# Altium schematic sheet Sch_sensors.SchDoc
size A
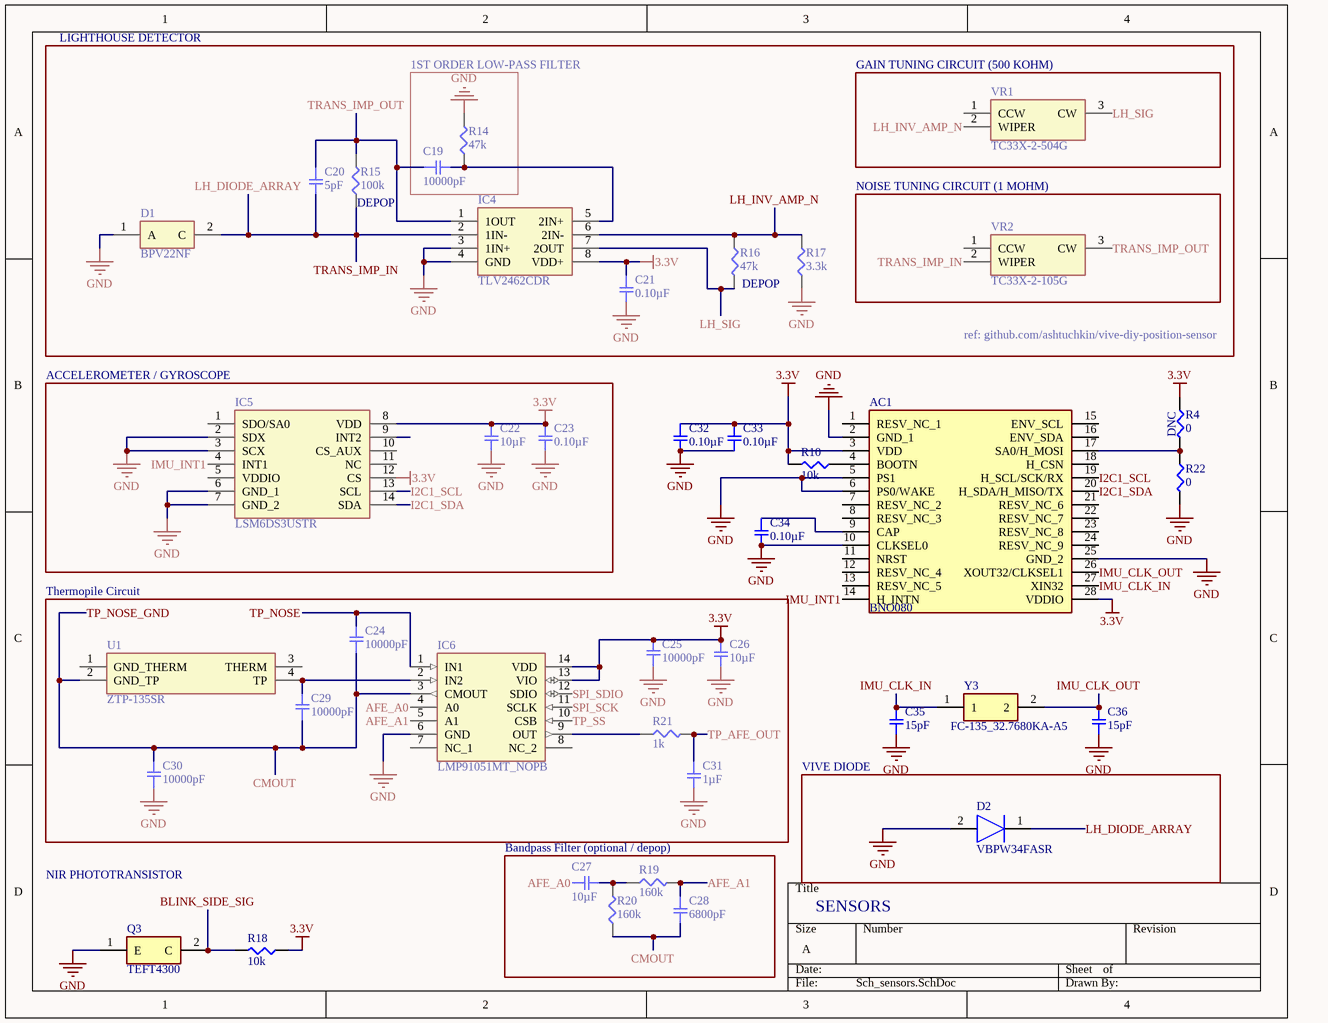
[diagram p0: Sch_sensors.SchDoc]

## Parts
AC1  BNO080  [BNO080]
C19  10000pF  [SMD-0402C]
C20  5pF  [SMD-0402C]
C21  0.10µF  [SMD-0402C]
C22  10µF  [SMD-0402C]
C23  0.10µF  [SMD-0402C]
C24  10000pF  [SMD-0402C]
C25  10000pF  [SMD-0402C]
C26  10µF  [SMD-0402C]
C27  10µF  [SMD-0402C]
C28  6800pF  [SMD-0402C]
C29  10000pF  [SMD-0402C]
C30  10000pF  [SMD-0402C]
C31  1µF  [SMD-0402C]
C32  0.10µF  [CAPC1005X55N]
C33  0.10µF  [CAPC1005X55N]
C34  0.10µF  [CAPC1005X55N]
C35  15pF  [CAPC1005X55N]
C36  15pF  [CAPC1005X55N]
D1  BPV22NF  [TO254P510X450X920-2P]
D2  VBPW34FASR  [VBPW34FASR]
IC4  TLV2462CDR  [SOIC127P600X175-8N]
IC5  LSM6DS3USTR  [LGA-14(2.5X3X0.86)]
IC6  LMP91051MT_NOPB  [SOP65P640X120-14N]
Q3  TEFT4300  [TEFT4300]
R4  0  [SMD-0402-RES]
R10  10k  [SMD-0402-RES]
R14  47k  [SMD-0402-RES]
R15  100k  [SMD-0402-RES]
R16  47k  [SMD-0402-RES]
R17  3.3k  [SMD-0402-RES]
R18  10k  [SMD-0402-RES]
R19  160k  [SMD-0402-RES]
R20  160k  [SMD-0402-RES]
R21  1k  [SMD-0402-RES]
R22  0  [SMD-0402-RES]
U1  ZTP-135SR  [ZTP-135SR]
VR1  TC33X-2-504G  [TC33X-2_1]
VR2  TC33X-2-105G  [TC33X-2_1]
Y3  FC-135_32.7680KA-A5  [FC135327680KAAG0]

## Blocks framed on the sheet
1ST ORDER LOW-PASS FILTER: C19 R14
GAIN TUNING CIRCUIT (500 KOHM): VR1
NOISE TUNING CIRCUIT (1 MOHM): VR2
ACCELEROMETER / GYROSCOPE: C22 C23 IC5
Thermopile Circuit: C24-C26 C29-C31 IC6 R21 U1
VIVE DIODE: D2
Bandpass Filter (optional / depop): C27 C28 R19 R20

## Nets
3.3V: AC1.3(VDD) AC1.28(VDDIO) C21.1 C22.1 C23.1 C25.2 C26.1 C32.1 C33.1 IC4.8(VDD+) IC5.8(VDD) IC5.12(CS) IC6.13(VIO) IC6.14(VDD) R4.1 R10.2 R18.1
GND: AC1.2(GND_1) AC1.5(PS1) AC1.6(PS0/WAKE) AC1.10(CLKSEL0) AC1.25(GND_2) C21.2 C22.2 C23.2 C25.1 C26.2 C30.1 C31.2 C32.2 C33.2 C34.2 C35.2 C36.2 D1.1(A) D2.2(K) IC4.3(1IN+) IC4.4(GND) IC5.2(SDX) IC5.3(SCX) IC5.6(GND_1) IC5.7(GND_2) IC6.6(GND) Q3.1(E) R14.2 R17.1 R22.2
AFE_A0: C27.1 IC6.4(A0)
AFE_A1: C28.1 IC6.5(A1) R19.2
BLINK_SIDE_SIG: Q3.2(C) R18.2
CMOUT: C24.1 C28.2 C29.1 C30.2 IC6.3(CMOUT) R20.1 U1.2(GND_TP)  [also labelled TP_NOSE_GND]
I2C1_SCL: AC1.19(H_SCL/SCK/RX) IC5.13(SCL)
I2C1_SDA: AC1.20(H_SDA/H_MISO/TX) IC5.14(SDA)
IMU_CLK_IN: AC1.27(XIN32) C35.1 Y3.1
IMU_CLK_OUT: AC1.26(XOUT32/CLKSEL1) C36.1 Y3.2
IMU_INT1: AC1.14(H_INTN) IC5.4(INT1)
LH_DIODE_ARRAY: C20.2 D1.2(C) D2.1(A) IC4.2(1IN-) R15.1 VR2.2(WIPER)  [also labelled TRANS_IMP_IN]
LH_INV_AMP_N: IC4.6(2IN-) R16.1 R17.2 VR1.2(WIPER)
LH_SIG: IC4.7(2OUT) R16.2 VR1.3(CW)
SPI_SCK: IC6.11(SCLK)
SPI_SDIO: IC6.12(SDIO)
TP_AFE_OUT: C31.1 R21.2
TP_NOSE: C24.2 IC6.1(IN1)
TP_SS: IC6.10(CSB)
TRANS_IMP_OUT: C19.1 C20.1 IC4.1(1OUT) R15.2 VR2.3(CW)
NetAC1_4: AC1.4(BOOTN) R10.1
NetAC1_9: AC1.9(CAP) C34.1
NetAC1_17: AC1.17(SA0/H_MOSI) R4.2 R22.1
NetC19_2: C19.2 IC4.5(2IN+) R14.1
NetC27_2: C27.2 R19.1 R20.2
NetC29_2: C29.2 IC6.2(IN2) U1.4(TP)
NetIC6_9: IC6.9(OUT) R21.1

Not connected (* = marked no-connect by the designer): AC1 1(RESV_NC_1) 7(RESV_NC_2) 8(RESV_NC_3) 11(NRST) 12(RESV_NC_4) 13(RESV_NC_5) 15(ENV_SCL) 16(ENV_SDA) 18(H_CSN) 21(RESV_NC_6) 22(RESV_NC_7) 23(RESV_NC_8) 24(RESV_NC_9); IC5 1(SDO/SA0) 5(VDDIO) 9(INT2) 10(CS_AUX) 11(NC); IC6 7(NC_1) 8(NC_2); U1 1(GND_THERM) 3(THERM); VR1 1(CCW); VR2 1(CCW)

## Notes on the sheet
- LIGHTHOUSE DETECTOR
- (near R15) DEPOP
- (near R16) DEPOP
- ref: github.com/ashtuchkin/vive-diy-position-sensor
- (near R4) DNC
- NIR PHOTOTRANSISTOR
- SENSORS

## Library data of the parts
AC1 = BNO080: Accelerometer; Manufacturer_Name: Hillcrest Laboratories; Datasheet Link: http://www.hillcrestlabs.com/download/5a05f340566d07c196001ec1; Height: 1.18mm; Manufacturer_Part_Number: BNO080
C19 C24 C25 C29 C30 = GCM155R71H103KA55D: CAP CER 10000PF 50V X7R 0402; Manufacturer: Murata Electronics North America; Factory Stock: 0; Unit Price (USD): 0.1; Minimum Quantity: 1; Tolerance: ±10%; Datasheets: http://www.murata.com/~/media/webrenewal/support/library/catalog/products/capacitor/mlcc/c03e.ashx; Image: //media.digikey.com/Renders/Murata%20Renders/ZRB-SERIES-0402.jpg; Digi-Key Part Number: 490-4762-1-ND; Part Number: GCM155R71H103KA55D; Quantity Available: 650067; @ qty: 0; Packaging: Cut Tape (CT); Series: GCM; Part Status: Active; Value: 10000pF; Voltage: 50V; Temperature Coefficient: X7R; Operating Temperature: -55°C ~ 125°C; Features: -; Ratings: AEC-Q200; Applications: Automotive; Mounting Type: Surface Mount, MLCC; Package / Case: 0402 (1005 Metric); Size / Dimension: 0.039" L x 0.020" W (1.00mm x 0.50mm); Height - Seated (Max): -; Thickness (Max): 0.022" (0.55mm); Lead Spacing: -; Lead Style: -
C20 = GJM1555C1H5R0BB01D: CAP CER 5PF 50V NP0 0402; Manufacturer: Murata Electronics North America; Factory Stock: 0; Unit Price (USD): 0.2; Minimum Quantity: 1; Tolerance: ±0.1pF; Temperature Coefficient: C0G, NP0; Datasheets: http://www.murata.com/~/media/webrenewal/support/library/catalog/products/capacitor/mlcc/c02e.pdf; Image: //media.digikey.com/Renders/Murata%20Renders/ZRB-SERIES-0402.jpg; Digi-Key Part Number: 490-8103-1-ND; Part Number: GJM1555C1H5R0BB01D; Quantity Available: 17055; @ qty: 0; Packaging: Cut Tape (CT); Series: GJM; Part Status: Active; Value: 5pF; Voltage: 50V; Operating Temperature: -55°C ~ 125°C; Features: High Q, Low Loss; Ratings: -; Applications: RF, Microwave, High Frequency; Mounting Type: Surface Mount, MLCC; Package / Case: 0402 (1005 Metric); Size / Dimension: 0.039" L x 0.020" W (1.00mm x 0.50mm); Height - Seated (Max): -; Thickness (Max): 0.022" (0.55mm); Lead Spacing: -; Lead Style: -
C21 C23 C32-C34 = GCM155R71C104KA55D: CAP CER 0.1UF 16V X7R 0402; Manufacturer: Murata Electronics North America; Factory Stock: 0; Unit Price (USD): 0.1; Minimum Quantity: 1; Tolerance: ±10%; Datasheets: http://www.murata.com/~/media/webrenewal/support/library/catalog/products/capacitor/mlcc/c03e.ashx; Image: //media.digikey.com/Renders/Murata%20Renders/ZRB-SERIES-0402.jpg; Digi-Key Part Number: 490-4759-1-ND; Part Number: GCM155R71C104KA55D; Quantity Available: 734194; @ qty: 0; Packaging: Cut Tape (CT); Series: GCM; Part Status: Active; Value: 0.10µF; Voltage: 16V; Temperature Coefficient: X7R; Operating Temperature: -55°C ~ 125°C; Features: -; Ratings: AEC-Q200; Applications: Automotive; Mounting Type: Surface Mount, MLCC; Package / Case: 0402 (1005 Metric); Size / Dimension: 0.039" L x 0.020" W (1.00mm x 0.50mm); Height - Seated (Max): -; Thickness (Max): 0.022" (0.55mm); Lead Spacing: -; Lead Style: -
C22 C26 C27 = GRJ155R60J106ME11D: CAP CER 10UF 6.3V X5R 0402; Manufacturer: Murata Electronics North America; Factory Stock: 0; Unit Price (USD): 0.23; Minimum Quantity: 1; Tolerance: ±20%; Datasheets: http://psearch.en.murata.com/capacitor/product/GRJ155R60J106ME11%23.pdf; Image: //media.digikey.com/Renders/Murata%20Renders/ZRB-SERIES-0402.jpg; Digi-Key Part Number: 490-13211-1-ND; Part Number: GRJ155R60J106ME11D; Quantity Available: 64064; @ qty: 0; Packaging: Cut Tape (CT); Series: GRJ; Part Status: Active; Value: 10µF; Voltage: 6.3V; Temperature Coefficient: X5R; Operating Temperature: -55°C ~ 85°C; Features: Derating Recommended, Soft Termination; Ratings: -; Applications: Boardflex Sensitive; Mounting Type: Surface Mount, MLCC; Package / Case: 0402 (1005 Metric); Size / Dimension: 0.039" L x 0.020" W (1.00mm x 0.50mm); Height - Seated (Max): -; Thickness (Max): 0.028" (0.70mm); Lead Spacing: -; Lead Style: -
C28 = GRM155R71E682KA01J: CAP CER 6800PF 25V X7R 0402; Manufacturer: Murata Electronics North America; Factory Stock: 0; Unit Price (USD): 0.1; Minimum Quantity: 1; Tolerance: ±10%; Datasheets: http://www.murata.com/~/media/webrenewal/support/library/catalog/products/capacitor/mlcc/c02e.pdf; Image: //media.digikey.com/Renders/Murata%20Renders/ZRB-SERIES-0402.jpg; Digi-Key Part Number: 490-11422-1-ND; Part Number: GRM155R71E682KA01J; Quantity Available: 44380; @ qty: 0; Packaging: Cut Tape (CT); Series: GRM; Part Status: Active; Value: 6800pF; Voltage: 25V; Temperature Coefficient: X7R; Operating Temperature: -55°C ~ 125°C; Features: -; Ratings: -; Applications: General Purpose; Mounting Type: Surface Mount, MLCC; Package / Case: 0402 (1005 Metric); Size / Dimension: 0.039" L x 0.020" W (1.00mm x 0.50mm); Height - Seated (Max): -; Thickness (Max): 0.022" (0.55mm); Lead Spacing: -; Lead Style: -
C31 = GCM155C71A105KE38D: CAP CER 1UF 10V X7S 0402; Manufacturer: Murata Electronics North America; Factory Stock: 0; Unit Price (USD): 0.12; Minimum Quantity: 1; Tolerance: ±10%; Datasheets: http://www.murata.com/~/media/webrenewal/support/library/catalog/products/capacitor/mlcc/c03e.ashx; Image: //media.digikey.com/Renders/Murata%20Renders/ZRB-SERIES-0402.jpg; Digi-Key Part Number: 490-13409-1-ND; Part Number: GCM155C71A105KE38D; Quantity Available: 7240; @ qty: 0; Packaging: Cut Tape (CT); Series: GCM; Part Status: Active; Value: 1µF; Voltage: 10V; Temperature Coefficient: X7S; Operating Temperature: -55°C ~ 125°C; Features: -; Ratings: AEC-Q200; Applications: Automotive; Mounting Type: Surface Mount, MLCC; Package / Case: 0402 (1005 Metric); Size / Dimension: 0.039" L x 0.020" W (1.00mm x 0.50mm); Height - Seated (Max): -; Thickness (Max): 0.022" (0.55mm); Lead Spacing: -; Lead Style: -
C35 C36 = GCM1555C1H150JA16D: CAP CER 15PF 50V NP0 0402; Manufacturer: Murata Electronics North America; Factory Stock: 0; Unit Price (USD): 0.1; Minimum Quantity: 1; Tolerance: ±5%; Temperature Coefficient: C0G, NP0; Datasheets: http://www.murata.com/~/media/webrenewal/support/library/catalog/products/capacitor/mlcc/c03e.ashx; Image: //media.digikey.com/Renders/Murata%20Renders/ZRB-SERIES-0402.jpg; Digi-Key Part Number: 490-11147-1-ND; Part Number: GCM1555C1H150JA16D; Quantity Available: 6185; @ qty: 0; Packaging: Cut Tape (CT); Series: GCM; Part Status: Active; Value: 15pF; Voltage: 50V; Operating Temperature: -55°C ~ 125°C; Features: -; Ratings: AEC-Q200; Applications: Automotive; Mounting Type: Surface Mount, MLCC; Package / Case: 0402 (1005 Metric); Size / Dimension: 0.039" L x 0.020" W (1.00mm x 0.50mm); Height - Seated (Max): -; Thickness (Max): 0.022" (0.55mm); Lead Spacing: -; Lead Style: -
D1 = BPV22NF: Diode; Manufacturer_Name: Vishay; Allied_Number: R1086877; Datasheet Link: http://www.vishay.com/docs/81509/bpv22nf.pdf; Height: 5.1mm; Manufacturer_Part_Number: BPV22NF; Mouser Part Number: 782-BPV22NF; Mouser Price/Stock: https://www.mouser.com/Search/Refine.aspx?Keyword=782-BPV22NF; RS Part Number: 6997604P; RS Price/Stock: http://uk.rs-online.com/web/p/products/6997604P; Allied Price/Stock: https://www.alliedelec.com/vishay-dale-bpv22nf/R1086877/
D2 = VBPW34FASR: Diode; Manufacturer_Name: Vishay; Datasheet Link: https://www.vishay.com/docs/81127/vbpw34fa.pdf; Height: 1.3mm; Manufacturer_Part_Number: VBPW34FASR; Mouser Part Number: 782-VBPW34FASR; Mouser Price/Stock: https://www.mouser.com/Search/Refine.aspx?Keyword=782-VBPW34FASR; RS Part Number: 7689401; RS Price/Stock: https://uk.rs-online.com/web/p/products/7689401
IC4 = TLV2462CDR: Integrated Circuit; Manufacturer_Name: Texas Instruments; Datasheet Link: http://www.ti.com/lit/gpn/tlv2462; Manufacturer_Part_Number: TLV2462CDR; Mouser Part Number: 595-TLV2462CDR; Mouser Price/Stock: https://www.mouser.com/Search/Refine.aspx?Keyword=595-TLV2462CDR; RS Part Number: 6610379; RS Price/Stock: https://uk.rs-online.com/web/p/products/6610379
IC5 = LSM6DS3USTR: Integrated Circuit; Manufacturer_Name: STMicroelectronics; Datasheet Link: http://www.st.com/content/ccc/resource/technical/document/datasheet/group0/2e/84/27/34/60/8d/49/f2/DM00237513/files/DM00237513.pdf/jcr:content/translations/en.DM00237513.pdf; Manufacturer_Part_Number: LSM6DS3USTR; Mouser Part Number: 511-LSM6DS3USTR; Mouser Price/Stock: https://www.mouser.com/Search/Refine.aspx?Keyword=511-LSM6DS3USTR
IC6 = LMP91051MT_NOPB: Integrated Circuit; Manufacturer_Name: Texas Instruments; Manufacturer_Part_Number: LMP91051MT/NOPB; Datasheet Link: http://www.ti.com/lit/ds/symlink/lmp91051.pdf; Height: 1.2mm; Mouser Part Number: 595-LMP91051MT/NOPB; Mouser Price/Stock: https://www.mouser.com/Search/Refine.aspx?Keyword=595-LMP91051MT%2FNOPB
Q3 = TEFT4300: Transistor; Manufacturer_Name: Vishay; Datasheet Link: https://componentsearchengine.com/Datasheets/2/TEFT4300.pdf; Manufacturer_Part_Number: TEFT4300; Mouser Part Number: 782-TEFT4300; Mouser Price/Stock: https://www.mouser.com/Search/Refine.aspx?Keyword=782-TEFT4300; RS Part Number: 7082731P; RS Price/Stock: http://uk.rs-online.com/web/p/products/7082731P
R4 R22 = ERJ-2GEJ103X: RES SMD 0K OHM 5% 1/10W 0402; Manufacturer: Panasonic Electronic Components; Unit Price (USD): 0.00350; @ qty: 1500; Minimum Quantity: 1; Power (Watts): 0.1W, 1/10W; Temperature Coefficient: ±200ppm/°C; Part Number: ERJ-2GEJ103X; Datasheets: http://industrial.panasonic.com/www-cgi/jvcr13pz.cgi?E+PZ+3+AOA0001+ERJ2GEJ103X+7+WW; Image: //media.digikey.com/Photos/Panasonic%20Photos/ERJ-PA2-Series.jpg; Digi-Key Part Number: P10KJCT-ND; Quantity Available: 2560215; Factory Stock: 0; Packaging: Cut Tape (CT); Series: ERJ; Part Status: Active; Value: 0; Tolerance: ±5%; Composition: Thick Film; Features: Automotive AEC-Q200; Operating Temperature: -55°C ~ 155°C; Package / Case: 0402 (1005 Metric); Supplier Device Package: 0402; Size / Dimension: 0.039" L x 0.020" W (1.00mm x 0.50mm); Height - Seated (Max): 0.016" (0.40mm); Number of Terminations: 2; Failure Rate: -
R10 R18 = ERJ-2GEJ103X: RES SMD 10K OHM 5% 1/10W 0402; Manufacturer: Panasonic Electronic Components; Factory Stock: 0; Unit Price (USD): 0.00350; @ qty: 1500; Minimum Quantity: 1; Power (Watts): 0.1W, 1/10W; Temperature Coefficient: ±200ppm/°C; Part Number: ERJ-2GEJ103X; Datasheets: http://industrial.panasonic.com/www-cgi/jvcr13pz.cgi?E+PZ+3+AOA0001+ERJ2GEJ103X+7+WW; Image: //media.digikey.com/Photos/Panasonic%20Photos/ERJ-PA2-Series.jpg; Digi-Key Part Number: P10KJCT-ND; Quantity Available: 2560215; Packaging: Cut Tape (CT); Series: ERJ; Part Status: Active; Value: 10k; Tolerance: ±5%; Composition: Thick Film; Features: Automotive AEC-Q200; Operating Temperature: -55°C ~ 155°C; Package / Case: 0402 (1005 Metric); Supplier Device Package: 0402; Size / Dimension: 0.039" L x 0.020" W (1.00mm x 0.50mm); Height - Seated (Max): 0.016" (0.40mm); Number of Terminations: 2; Failure Rate: -
R14 R16 = ERJ-2GEJ473X: RES SMD 47K OHM 5% 1/10W 0402; Manufacturer: Panasonic Electronic Components; Factory Stock: 0; Unit Price (USD): 0.00350; @ qty: 1500; Minimum Quantity: 1; Power (Watts): 0.1W, 1/10W; Temperature Coefficient: ±200ppm/°C; Part Number: ERJ-2GEJ473X; Datasheets: http://industrial.panasonic.com/www-cgi/jvcr13pz.cgi?E+PZ+3+AOA0001+ERJ2GEJ473X+7+WW; Image: //media.digikey.com/Photos/Panasonic%20Photos/ERJ-PA2-Series.jpg; Digi-Key Part Number: P47KJCT-ND; Quantity Available: 5182645; Packaging: Cut Tape (CT); Series: ERJ; Part Status: Active; Value: 47k; Tolerance: ±5%; Composition: Thick Film; Features: Automotive AEC-Q200; Operating Temperature: -55°C ~ 155°C; Package / Case: 0402 (1005 Metric); Supplier Device Package: 0402; Size / Dimension: 0.039" L x 0.020" W (1.00mm x 0.50mm); Height - Seated (Max): 0.016" (0.40mm); Number of Terminations: 2; Failure Rate: -
R15 = ERJ-2GEJ104X: RES SMD 100K OHM 5% 1/10W 0402; Manufacturer: Panasonic Electronic Components; Factory Stock: 0; Unit Price (USD): 0.00350; @ qty: 1500; Minimum Quantity: 1; Power (Watts): 0.1W, 1/10W; Temperature Coefficient: ±200ppm/°C; Part Number: ERJ-2GEJ104X; Datasheets: http://industrial.panasonic.com/www-cgi/jvcr13pz.cgi?E+PZ+3+AOA0001+ERJ2GEJ104X+7+WW; Image: //media.digikey.com/Photos/Panasonic%20Photos/ERJ-PA2-Series.jpg; Digi-Key Part Number: P100KJCT-ND; Quantity Available: 2387986; Packaging: Cut Tape (CT); Series: ERJ; Part Status: Active; Value: 100k; Tolerance: ±5%; Composition: Thick Film; Features: Automotive AEC-Q200; Operating Temperature: -55°C ~ 155°C; Package / Case: 0402 (1005 Metric); Supplier Device Package: 0402; Size / Dimension: 0.039" L x 0.020" W (1.00mm x 0.50mm); Height - Seated (Max): 0.016" (0.40mm); Number of Terminations: 2; Failure Rate: -
R17 = ERJ-2GEJ332X: RES SMD 3.3K OHM 5% 1/10W 0402; Manufacturer: Panasonic Electronic Components; Factory Stock: 0; Unit Price (USD): 0.00350; @ qty: 1500; Minimum Quantity: 1; Power (Watts): 0.1W, 1/10W; Temperature Coefficient: ±200ppm/°C; Part Number: ERJ-2GEJ332X; Datasheets: http://industrial.panasonic.com/www-cgi/jvcr13pz.cgi?E+PZ+3+AOA0001+ERJ2GEJ332X+7+WW; Image: //media.digikey.com/Photos/Panasonic%20Photos/ERJ-PA2-Series.jpg; Digi-Key Part Number: P3.3KJCT-ND; Quantity Available: 514266; Packaging: Cut Tape (CT); Series: ERJ; Part Status: Active; Value: 3.3k; Tolerance: ±5%; Composition: Thick Film; Features: Automotive AEC-Q200; Operating Temperature: -55°C ~ 155°C; Package / Case: 0402 (1005 Metric); Supplier Device Package: 0402; Size / Dimension: 0.039" L x 0.020" W (1.00mm x 0.50mm); Height - Seated (Max): 0.016" (0.40mm); Number of Terminations: 2; Failure Rate: -
R19 R20 = ERJ-2GEJ164X: RES SMD 160K OHM 5% 1/10W 0402; Manufacturer: Panasonic Electronic Components; Factory Stock: 0; Unit Price (USD): 0.00350; @ qty: 1500; Minimum Quantity: 1; Power (Watts): 0.1W, 1/10W; Temperature Coefficient: ±200ppm/°C; Part Number: ERJ-2GEJ164X; Datasheets: http://industrial.panasonic.com/www-cgi/jvcr13pz.cgi?E+PZ+3+AOA0001+ERJ2GEJ164X+7+WW; Image: //media.digikey.com/Photos/Panasonic%20Photos/ERJ-PA2-Series.jpg; Digi-Key Part Number: P160KJCT-ND; Quantity Available: 64191; Packaging: Cut Tape (CT); Series: ERJ; Part Status: Active; Value: 160k; Tolerance: ±5%; Composition: Thick Film; Features: Automotive AEC-Q200; Operating Temperature: -55°C ~ 155°C; Package / Case: 0402 (1005 Metric); Supplier Device Package: 0402; Size / Dimension: 0.039" L x 0.020" W (1.00mm x 0.50mm); Height - Seated (Max): 0.016" (0.40mm); Number of Terminations: 2; Failure Rate: -
R21 = ERJ-2GEJ102X: RES SMD 1K OHM 5% 1/10W 0402; Manufacturer: Panasonic Electronic Components; Factory Stock: 0; Unit Price (USD): 0.00350; @ qty: 1500; Minimum Quantity: 1; Power (Watts): 0.1W, 1/10W; Temperature Coefficient: ±200ppm/°C; Part Number: ERJ-2GEJ102X; Datasheets: http://industrial.panasonic.com/www-cgi/jvcr13pz.cgi?E+PZ+3+AOA0001+ERJ2GEJ102X+7+WW; Image: //media.digikey.com/Photos/Panasonic%20Photos/ERJ-PA2-Series.jpg; Digi-Key Part Number: P1.0KJCT-ND; Quantity Available: 1939857; Packaging: Cut Tape (CT); Series: ERJ; Part Status: Active; Value: 1k; Tolerance: ±5%; Composition: Thick Film; Features: Automotive AEC-Q200; Operating Temperature: -55°C ~ 155°C; Package / Case: 0402 (1005 Metric); Supplier Device Package: 0402; Size / Dimension: 0.039" L x 0.020" W (1.00mm x 0.50mm); Height - Seated (Max): 0.016" (0.40mm); Number of Terminations: 2; Failure Rate: -
U1 = ZTP-135SR: Undefined or Miscellaneous; Manufacturer_Name: Amphenol Advanced Sensors; Allied_Number: 70282698; Datasheet Link: https://www.amphenol-sensors.com/en/component/edocman/370-thermopile-ir-sensor-applications/download?Itemid=7967; Manufacturer_Part_Number: ZTP-135SR; Mouser Part Number: 527-ZTP-135SR; Mouser Price/Stock: https://www.mouser.com/Search/Refine.aspx?Keyword=527-ZTP-135SR; Allied Price/Stock: https://www.alliedelec.com/amphenol-advanced-sensors-ztp-135sr/70282698/
VR1 VR2 = TC33X-2-504G: Variable Resistor; Manufacturer_Name: Bourns; Datasheet Link: https://componentsearchengine.com/Datasheets/1/TC33X-2-504G.pdf
  VR1: Manufacturer_Part_Number: TC33X-2-504G; Mouser Part Number: 652-TC33X-2-504G; Mouser Price/Stock: https://www.mouser.com/Search/Refine.aspx?Keyword=652-TC33X-2-504G
  VR2: Manufacturer_Part_Number: TC33X-2-105G; Mouser Part Number: 652-TC33X-2-105G; Mouser Price/Stock: https://www.mouser.com/ProductDetail/Bourns/TC33X-2-105G?qs=CKM7WkAQrJp66Z0w10bj4w%3D%3D
Y3 = FC-135_32.7680KA-A3: Crystal or Oscillator; Manufacturer_Name: Epson Timing; Manufacturer_Part_Number: FC-135 32.7680KA-A5; Datasheet Link: https://support.epson.biz/td/api/doc_check.php?dl=brief_fc-135r_en.pdf; Height: 0mm; Mouser Part Number: 732-FC135-32.76KAA3; Mouser Price/Stock: https://www.mouser.com/Search/Refine.aspx?Keyword=732-FC135-32.76KAA3